# EAGLE schematic untitled - 複製 (EAGLE 9.6.2)
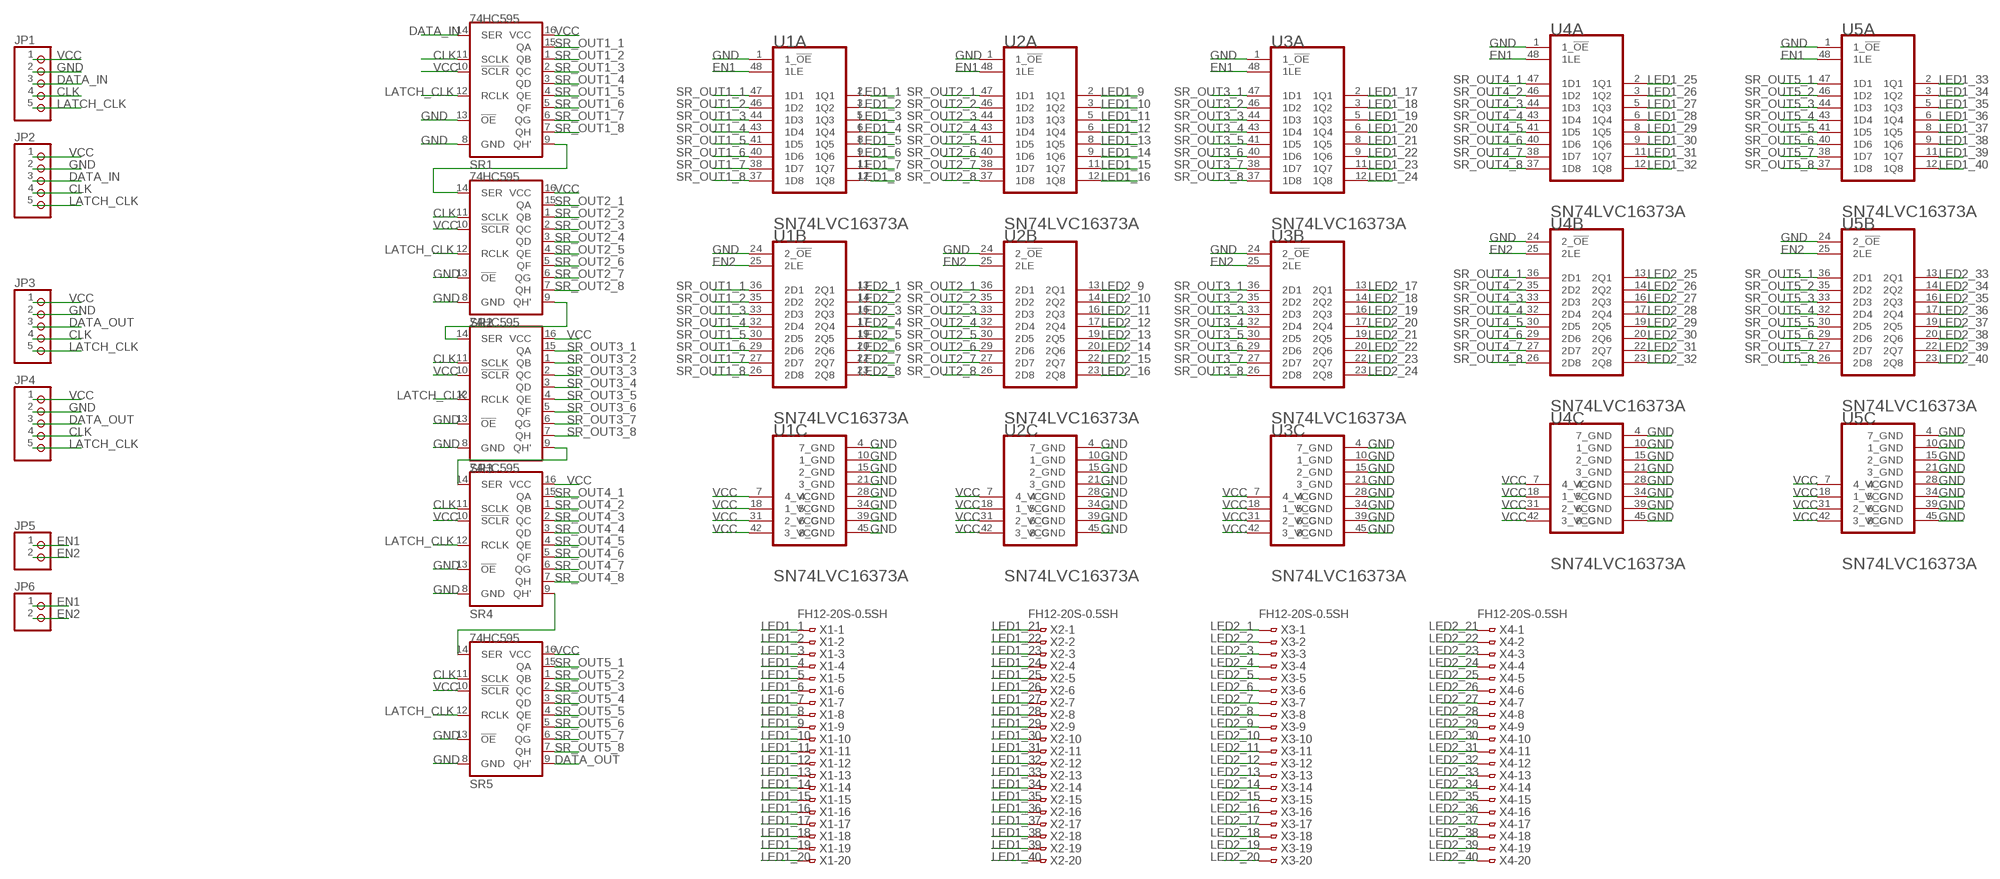
[diagram p0: schematic, sheet 1]

## Parts
JP1  PINHD-1X5  [1X05]
JP2  PINHD-1X5  [1X05]
JP3  PINHD-1X5  [1X05]
JP4  PINHD-1X5  [1X05]
JP5  PINHD-1X2  [1X02]
JP6  PINHD-1X2  [1X02]
SR1  74HC595  [SO16]
SR2  74HC595  [SO16]
SR3  74HC595  [SO16]
SR4  74HC595  [SO16]
SR5  74HC595  [SO16]
U1  TEXAS_INSTRUMENTS_SN74LVC16373ATEXAS_INSTRUMENTS_SN74LVC16373A_0_2  [TEXAS_INSTRUMENTS_SN74LVC16373A_2]
U2  TEXAS_INSTRUMENTS_SN74LVC16373ATEXAS_INSTRUMENTS_SN74LVC16373A_0_2  [TEXAS_INSTRUMENTS_SN74LVC16373A_2]
U3  TEXAS_INSTRUMENTS_SN74LVC16373ATEXAS_INSTRUMENTS_SN74LVC16373A_0_2  [TEXAS_INSTRUMENTS_SN74LVC16373A_2]
U4  TEXAS_INSTRUMENTS_SN74LVC16373ATEXAS_INSTRUMENTS_SN74LVC16373A_0_2  [TEXAS_INSTRUMENTS_SN74LVC16373A_2]
U5  TEXAS_INSTRUMENTS_SN74LVC16373ATEXAS_INSTRUMENTS_SN74LVC16373A_0_2  [TEXAS_INSTRUMENTS_SN74LVC16373A_2]
X1  FH12-20S-0.5SH  [FH12-20S-0.5SH]
X2  FH12-20S-0.5SH  [FH12-20S-0.5SH]
X3  FH12-20S-0.5SH  [FH12-20S-0.5SH]
X4  FH12-20S-0.5SH  [FH12-20S-0.5SH]

## Nets
CLK: JP1.4 JP2.4 JP3.4 JP4.4 SR1.11(SCLK) SR2.11(SCLK) SR3.11(SCLK) SR4.11(SCLK) SR5.11(SCLK)
DATA_IN: JP1.3 JP2.3 SR1.14(SER)
DATA_OUT: JP3.3 JP4.3 SR5.9(QH')
EN1: JP5.1 JP6.1 U1.48(A:1LE) U2.48(A:1LE) U3.48(A:1LE) U4.48(A:1LE) U5.48(A:1LE)
EN2: JP5.2 JP6.2 U1.25(B:2LE) U2.25(B:2LE) U3.25(B:2LE) U4.25(B:2LE) U5.25(B:2LE)
GND: JP1.2 JP2.2 JP3.2 JP4.2 SR1.8(GND) SR1.13(!OE) SR2.8(GND) SR2.13(!OE) SR3.8(GND) SR3.13(!OE) SR4.8(GND) SR4.13(!OE) SR5.8(GND) SR5.13(!OE) U1.1(A:1_!OE!) U1.4(C:7_GND) U1.10(C:1_GND) U1.15(C:2_GND) U1.21(C:3_GND) U1.24(B:2_!OE!) U1.28(C:4_GND) U1.34(C:5_GND) U1.39(C:6_GND) U1.45(C:8_GND) U2.1(A:1_!OE!) U2.4(C:7_GND) U2.10(C:1_GND) U2.15(C:2_GND) U2.21(C:3_GND) U2.24(B:2_!OE!) U2.28(C:4_GND) U2.34(C:5_GND) U2.39(C:6_GND) U2.45(C:8_GND) U3.1(A:1_!OE!) U3.4(C:7_GND) U3.10(C:1_GND) U3.15(C:2_GND) U3.21(C:3_GND) U3.24(B:2_!OE!) U3.28(C:4_GND) U3.34(C:5_GND) U3.39(C:6_GND) U3.45(C:8_GND) U4.1(A:1_!OE!) U4.4(C:7_GND) U4.10(C:1_GND) U4.15(C:2_GND) U4.21(C:3_GND) U4.24(B:2_!OE!) U4.28(C:4_GND) U4.34(C:5_GND) U4.39(C:6_GND) U4.45(C:8_GND) U5.1(A:1_!OE!) U5.4(C:7_GND) U5.10(C:1_GND) U5.15(C:2_GND) U5.21(C:3_GND) U5.24(B:2_!OE!) U5.28(C:4_GND) U5.34(C:5_GND) U5.39(C:6_GND) U5.45(C:8_GND)
LATCH_CLK: JP1.5 JP2.5 JP3.5 JP4.5 SR1.12(RCLK) SR2.12(RCLK) SR3.12(RCLK) SR4.12(RCLK) SR5.12(RCLK)
LED1_1: U1.2(A:1Q1) X1.1
LED1_2: U1.3(A:1Q2) X1.2
LED1_3: U1.5(A:1Q3) X1.3
LED1_4: U1.6(A:1Q4) X1.4
LED1_5: U1.8(A:1Q5) X1.5
LED1_6: U1.9(A:1Q6) X1.6
LED1_7: U1.11(A:1Q7) X1.7
LED1_8: U1.12(A:1Q8) X1.8
LED1_9: U2.2(A:1Q1) X1.9
LED1_10: U2.3(A:1Q2) X1.10
LED1_11: U2.5(A:1Q3) X1.11
LED1_12: U2.6(A:1Q4) X1.12
LED1_13: U2.8(A:1Q5) X1.13
LED1_14: U2.9(A:1Q6) X1.14
LED1_15: U2.11(A:1Q7) X1.15
LED1_16: U2.12(A:1Q8) X1.16
LED1_17: U3.2(A:1Q1) X1.17
LED1_18: U3.3(A:1Q2) X1.18
LED1_19: U3.5(A:1Q3) X1.19
LED1_20: U3.6(A:1Q4) X1.20
LED1_21: U3.8(A:1Q5) X2.1
LED1_22: U3.9(A:1Q6) X2.2
LED1_23: U3.11(A:1Q7) X2.3
LED1_24: U3.12(A:1Q8) X2.4
LED1_25: U4.2(A:1Q1) X2.5
LED1_26: U4.3(A:1Q2) X2.6
LED1_27: U4.5(A:1Q3) X2.7
LED1_28: U4.6(A:1Q4) X2.8
LED1_29: U4.8(A:1Q5) X2.9
LED1_30: U4.9(A:1Q6) X2.10
LED1_31: U4.11(A:1Q7) X2.11
LED1_32: U4.12(A:1Q8) X2.12
LED1_33: U5.2(A:1Q1) X2.13
LED1_34: U5.3(A:1Q2) X2.14
LED1_35: U5.5(A:1Q3) X2.15
LED1_36: U5.6(A:1Q4) X2.16
LED1_37: U5.8(A:1Q5) X2.17
LED1_38: U5.9(A:1Q6) X2.18
LED1_39: U5.11(A:1Q7) X2.19
LED1_40: U5.12(A:1Q8) X2.20
LED2_1: U1.13(B:2Q1) X3.1
LED2_2: U1.14(B:2Q2) X3.2
LED2_3: U1.16(B:2Q3) X3.3
LED2_4: U1.17(B:2Q4) X3.4
LED2_5: U1.19(B:2Q5) X3.5
LED2_6: U1.20(B:2Q6) X3.6
LED2_7: U1.22(B:2Q7) X3.7
LED2_8: U1.23(B:2Q8) X3.8
LED2_9: U2.13(B:2Q1) X3.9
LED2_10: U2.14(B:2Q2) X3.10
LED2_11: U2.16(B:2Q3) X3.11
LED2_12: U2.17(B:2Q4) X3.12
LED2_13: U2.19(B:2Q5) X3.13
LED2_14: U2.20(B:2Q6) X3.14
LED2_15: U2.22(B:2Q7) X3.15
LED2_16: U2.23(B:2Q8) X3.16
LED2_17: U3.13(B:2Q1) X3.17
LED2_18: U3.14(B:2Q2) X3.18
LED2_19: U3.16(B:2Q3) X3.19
LED2_20: U3.17(B:2Q4) X3.20
LED2_21: U3.19(B:2Q5) X4.1
LED2_22: U3.20(B:2Q6) X4.2
LED2_23: U3.22(B:2Q7) X4.3
LED2_24: U3.23(B:2Q8) X4.4
LED2_25: U4.13(B:2Q1) X4.5
LED2_26: U4.14(B:2Q2) X4.6
LED2_27: U4.16(B:2Q3) X4.7
LED2_28: U4.17(B:2Q4) X4.8
LED2_29: U4.19(B:2Q5) X4.9
LED2_30: U4.20(B:2Q6) X4.10
LED2_31: U4.22(B:2Q7) X4.11
LED2_32: U4.23(B:2Q8) X4.12
LED2_33: U5.13(B:2Q1) X4.13
LED2_34: U5.14(B:2Q2) X4.14
LED2_35: U5.16(B:2Q3) X4.15
LED2_36: U5.17(B:2Q4) X4.16
LED2_37: U5.19(B:2Q5) X4.17
LED2_38: U5.20(B:2Q6) X4.18
LED2_39: U5.22(B:2Q7) X4.19
LED2_40: U5.23(B:2Q8) X4.20
N$1: SR1.9(QH') SR2.14(SER)
N$2: SR4.9(QH') SR5.14(SER)
N$4: SR3.9(QH') SR4.14(SER)
N$8: SR2.9(QH') SR3.14(SER)
SR_OUT1_1: SR1.15(QA) U1.36(B:2D1) U1.47(A:1D1)
SR_OUT1_2: SR1.1(QB) U1.35(B:2D2) U1.46(A:1D2)
SR_OUT1_3: SR1.2(QC) U1.33(B:2D3) U1.44(A:1D3)
SR_OUT1_4: SR1.3(QD) U1.32(B:2D4) U1.43(A:1D4)
SR_OUT1_5: SR1.4(QE) U1.30(B:2D5) U1.41(A:1D5)
SR_OUT1_6: SR1.5(QF) U1.29(B:2D6) U1.40(A:1D6)
SR_OUT1_7: SR1.6(QG) U1.27(B:2D7) U1.38(A:1D7)
SR_OUT1_8: SR1.7(QH) U1.26(B:2D8) U1.37(A:1D8)
SR_OUT2_1: SR2.15(QA) U2.36(B:2D1) U2.47(A:1D1)
SR_OUT2_2: SR2.1(QB) U2.35(B:2D2) U2.46(A:1D2)
SR_OUT2_3: SR2.2(QC) U2.33(B:2D3) U2.44(A:1D3)
SR_OUT2_4: SR2.3(QD) U2.32(B:2D4) U2.43(A:1D4)
SR_OUT2_5: SR2.4(QE) U2.30(B:2D5) U2.41(A:1D5)
SR_OUT2_6: SR2.5(QF) U2.29(B:2D6) U2.40(A:1D6)
SR_OUT2_7: SR2.6(QG) U2.27(B:2D7) U2.38(A:1D7)
SR_OUT2_8: SR2.7(QH) U2.26(B:2D8) U2.37(A:1D8)
SR_OUT3_1: SR3.15(QA) U3.36(B:2D1) U3.47(A:1D1)
SR_OUT3_2: SR3.1(QB) U3.35(B:2D2) U3.46(A:1D2)
SR_OUT3_3: SR3.2(QC) U3.33(B:2D3) U3.44(A:1D3)
SR_OUT3_4: SR3.3(QD) U3.32(B:2D4) U3.43(A:1D4)
SR_OUT3_5: SR3.4(QE) U3.30(B:2D5) U3.41(A:1D5)
SR_OUT3_6: SR3.5(QF) U3.29(B:2D6) U3.40(A:1D6)
SR_OUT3_7: SR3.6(QG) U3.27(B:2D7) U3.38(A:1D7)
SR_OUT3_8: SR3.7(QH) U3.26(B:2D8) U3.37(A:1D8)
SR_OUT4_1: SR4.15(QA) U4.36(B:2D1) U4.47(A:1D1)
SR_OUT4_2: SR4.1(QB) U4.35(B:2D2) U4.46(A:1D2)
SR_OUT4_3: SR4.2(QC) U4.33(B:2D3) U4.44(A:1D3)
SR_OUT4_4: SR4.3(QD) U4.32(B:2D4) U4.43(A:1D4)
SR_OUT4_5: SR4.4(QE) U4.30(B:2D5) U4.41(A:1D5)
SR_OUT4_6: SR4.5(QF) U4.29(B:2D6) U4.40(A:1D6)
SR_OUT4_7: SR4.6(QG) U4.27(B:2D7) U4.38(A:1D7)
SR_OUT4_8: SR4.7(QH) U4.26(B:2D8) U4.37(A:1D8)
SR_OUT5_1: SR5.15(QA) U5.36(B:2D1) U5.47(A:1D1)
SR_OUT5_2: SR5.1(QB) U5.35(B:2D2) U5.46(A:1D2)
SR_OUT5_3: SR5.2(QC) U5.33(B:2D3) U5.44(A:1D3)
SR_OUT5_4: SR5.3(QD) U5.32(B:2D4) U5.43(A:1D4)
SR_OUT5_5: SR5.4(QE) U5.30(B:2D5) U5.41(A:1D5)
SR_OUT5_6: SR5.5(QF) U5.29(B:2D6) U5.40(A:1D6)
SR_OUT5_7: SR5.6(QG) U5.27(B:2D7) U5.38(A:1D7)
SR_OUT5_8: SR5.7(QH) U5.26(B:2D8) U5.37(A:1D8)
VCC: JP1.1 JP2.1 JP3.1 JP4.1 SR1.10(!SCLR) SR1.16(VCC) SR2.10(!SCLR) SR2.16(VCC) SR3.10(!SCLR) SR3.16(VCC) SR4.10(!SCLR) SR4.16(VCC) SR5.10(!SCLR) SR5.16(VCC) U1.7(C:4_VCC) U1.18(C:1_VCC) U1.31(C:2_VCC) U1.42(C:3_VCC) U2.7(C:4_VCC) U2.18(C:1_VCC) U2.31(C:2_VCC) U2.42(C:3_VCC) U3.7(C:4_VCC) U3.18(C:1_VCC) U3.31(C:2_VCC) U3.42(C:3_VCC) U4.7(C:4_VCC) U4.18(C:1_VCC) U4.31(C:2_VCC) U4.42(C:3_VCC) U5.7(C:4_VCC) U5.18(C:1_VCC) U5.31(C:2_VCC) U5.42(C:3_VCC)

## Library data of the parts
JP1-JP4 = pinhead:PINHD-1X5: PIN HEADER
JP5 JP6 = pinhead:PINHD-1X2: PIN HEADER
SR1-SR5 = 74HC595:74HC595: 8-bit SHIFT REGISTER, output latch Check availability <https://pricing.snapeda.com/parts/74HC595/Nexperia/view-part?ref=eda>; AVAILABILITY: In Stock; DESCRIPTION: Shift Register Single 8-Bit Serial to Serial/Parallel 16-Pin SSOP T/R; MF: Nexperia; MP: 74HC595; PACKAGE: None; PRICE: None
U1-U5 = SN74LVC16373A(NEW_16BIT_LATCH):TEXAS_INSTRUMENTS_SN74LVC16373A: TI-SN54_74XXXXX16X373X-48; 3_STATE_OUTPUT: Yes; BITS: 16; CIIVA_IDS: 19307467; CODE__JEDEC: MO-153; DATASHEET_VERSION: SCAS755B; FOOTPRINT_VARIANT_NAME_0: Level C; FOOTPRINT_VARIANT_NAME_1: Level B; FOOTPRINT_VARIANT_NAME_2: Level A; F__NOM_VOLTAGEMAXMHZ: 100; ICC__NOM_VOLTAGEMAXMA: 0.02; IMPORTED: yes; IMPORTED_FROM: vault; IMPORT_TS: 1521844253; INPUT_TYPE: CMOS,TTL; LOGIC: true; MF: Texas Instruments; MPN: SN74LVC16373A; OPERATING_TEMPERATURE_RANGEC: -40 to 125,-40 to 85; OUTPUT_DRIVE_IOLIOHMAXMA: 24/-24; OUTPUT_LOGIC: Non-inverted; OUTPUT_TYPE: CMOS; PACKAGE: DGG0048A; PREFIX: U; RATING: Catalog; RELEASE_DATE: 1459328133; SCHMITT_TRIGGER: No; STATIC_CURRENT: 0.02; TECHNOLOGY_FAMILY: LVC; TPD__NOM_VOLTAGEMAXNS: 6.4,4.2,4.9; VAULT_GUID: 00FB3570-8383-4C82-A038-A58A20934C8C; VAULT_REVISION: B0EE8CD6-9ACA-4FFF-ACFC-C0240CF4C59E; VCC_MAX_V: 3.6; VCC_MIN_V: 1.65; VOLTAGE_NOM_V: 1.8,2.5,2.7,3.3
X1-X4 = con-hirose:FH12-20S-0.5S: 0.5mm Pitch Connectors For FPC/FFC Source: Data sheet <http://www.hirose.co.jp/cataloge_hp/e58605370.pdf>; MPN: FH12-20S-0.5SH(55); OC_FARNELL: 1324549; OC_NEWARK: 34M6166